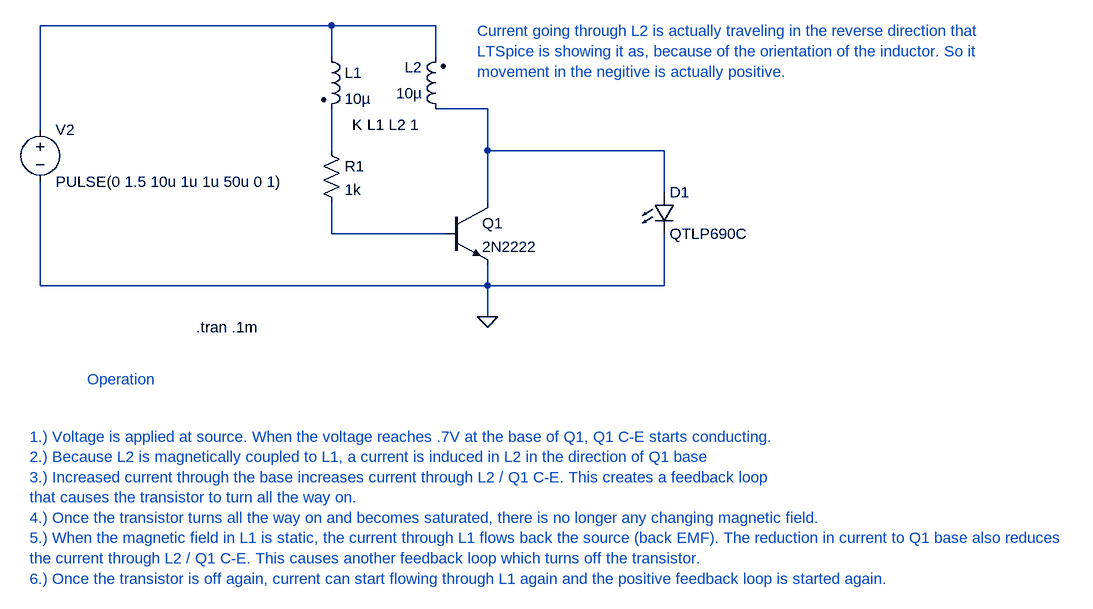
[diagram p0: schematic JouleThief.asc]
JouleThief.asc, the LTspice schematic file:
Version 4
SHEET 1 2680 872
WIRE 752 0 304 0
WIRE 912 0 752 0
WIRE 752 48 752 0
WIRE 912 48 912 0
WIRE 992 128 912 128
WIRE 304 160 304 0
WIRE 752 192 752 128
WIRE 992 192 992 128
WIRE 1264 192 992 192
WIRE 1264 256 1264 192
WIRE 992 272 992 192
WIRE 752 320 752 272
WIRE 928 320 752 320
WIRE 304 400 304 240
WIRE 992 400 992 368
WIRE 992 400 304 400
WIRE 1264 400 1264 320
WIRE 1264 400 992 400
WIRE 992 448 992 400
FLAG 992 448 0
SYMBOL ind2 736 32 R0
SYMATTR InstName L1
SYMATTR Value 10µ
SYMATTR Type ind
SYMBOL ind2 928 144 R180
WINDOW 0 36 80 Left 2
WINDOW 3 36 40 Left 2
SYMATTR InstName L2
SYMATTR Value 10µ
SYMATTR Type ind
SYMBOL res 736 176 R0
SYMATTR InstName R1
SYMATTR Value 1k
SYMBOL npn 928 272 R0
SYMATTR InstName Q1
SYMATTR Value 2N2222
SYMBOL LED 1248 256 R0
SYMATTR InstName D1
SYMATTR Value QTLP690C
SYMATTR Description Diode
SYMATTR Type diode
SYMBOL voltage 304 144 R0
WINDOW 123 0 0 Left 0
WINDOW 39 0 0 Left 0
SYMATTR InstName V2
SYMATTR Value PULSE(0 1.5 10u 1u 1u 50u 0 1)
TEXT 784 152 Left 2 !K L1 L2 1
TEXT 544 464 Left 2 !.tran .1m
TEXT 376 544 Left 2 ;Operation
TEXT 288 632 Left 2 ;1.) Voltage is applied at source. When the voltage reaches .7V at the base of Q1, Q1 C-E starts conducting. \n2.) Because L2 is magnetically coupled to L1, a current is induced in L2 in the direction of Q1 base\n3.) Increased current through the base increases current through L2 / Q1 C-E. This creates a feedback loop\nthat causes the transistor to turn all the way on.\n4.) Once the transistor turns all the way on and becomes saturated, there is no longer any changing magnetic field.\n5.) When the magnetic field in L1 is static, the current through L1 flows back the source (back EMF). The reduction in current to Q1 base also reduces\nthe current through L2 / Q1 C-E. This causes another feedback loop which turns off the transistor.\n6.) Once the transistor is off again, current can start flowing through L1 again and the positive feedback loop is started again.
TEXT 976 8 Left 2 ;Current going through L2 is actually traveling in the reverse direction that\nLTSpice is showing it as, because of the orientation of the inductor. So it\nmovement in the negitive is actually positive.

The netlist it stands for:
* JouleThief.asc
L1 N001 N003 10µ
L2 N002 N001 10µ
R1 N003 N004 1k
Q1 N002 N004 0 0 2N2222
D1 N002 0 QTLP690C
V2 N001 0 PULSE(0 1.5 10u 1u 1u 50u 0 1)
.model D D
.lib standard.dio
.model NPN NPN
.model PNP PNP
.lib standard.bjt
K L1 L2 1
.tran .1m
* Operation
* 1.) Voltage is applied at source. When the voltage reaches .7V at the base of Q1, Q1 C-E starts conducting.
* 2.) Because L2 is magnetically coupled to L1, a current is induced in L2 in the direction of Q1 base
* 3.) Increased current through the base increases current through L2 / Q1 C-E. This creates a feedback loop
* that causes the transistor to turn all the way on.
* 4.) Once the transistor turns all the way on and becomes saturated, there is no longer any changing magnetic field.
* 5.) When the magnetic field in L1 is static, the current through L1 flows back the source (back EMF). The reduction in current to Q1 base also reduces
* the current through L2 / Q1 C-E. This causes another feedback loop which turns off the transistor.
* 6.) Once the transistor is off again, current can start flowing through L1 again and the positive feedback loop is started again.
* Current going through L2 is actually traveling in the reverse direction that
* LTSpice is showing it as, because of the orientation of the inductor. So it
* movement in the negitive is actually positive.
.backanno
.end